# EAGLE design Freq.Counter.V.1.0 (EAGLE 6.3)
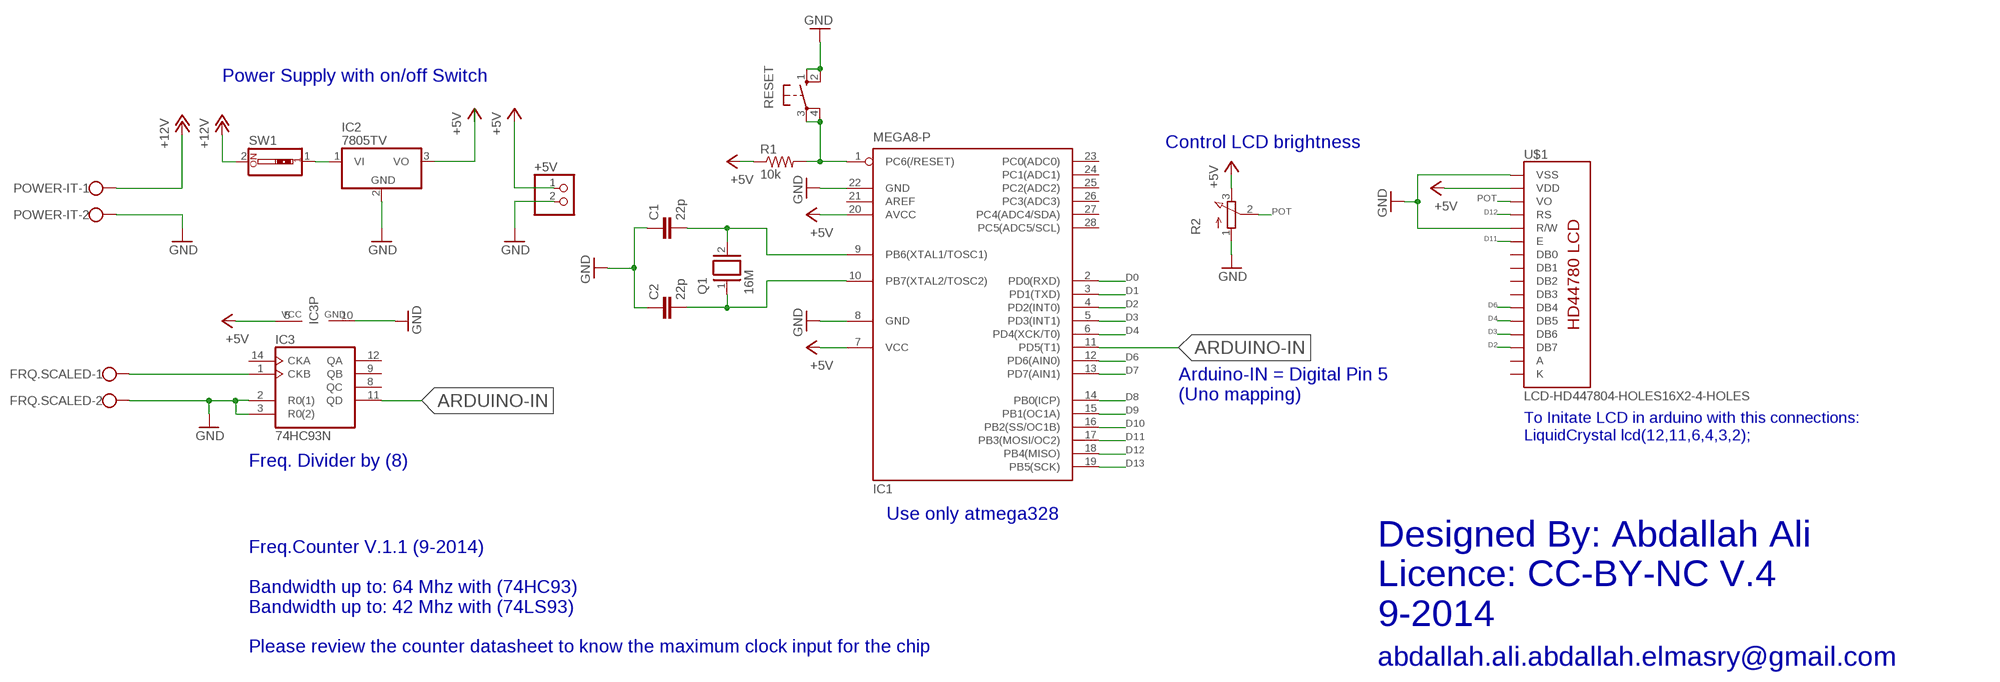
[diagram p0: schematic, sheet 1]

## Parts
+5V  PINHD-1X2  [1X02]
C1  22p  C-EU025-025X050  [C025-025X050]
C2  22p  C-EU025-025X050  [C025-025X050]
FRQ.SCALED  W237-102  [W237-102]
IC1  MEGA8-P  [DIL28-3]
IC2  7805TV  [TO220V]
IC3  74HC93N  [DIL14]
POWER-IT  W237-102  [W237-102]
Q1  16M  XTAL/S  [QS]
R1  10k  R-US_0207/10  [0207/10]
R2  3RP/1610N  [3RP/1610N]
RESET  10-XX  [B3F-10XX]
SW1  SW_DIP-1  [EDG-01]
U$1  LCD-HD447804-HOLES16X2-4-HOLES  [LCD-16X2-4HOLES]

## Nets
+5V: +5V.1 IC1.7(VCC) IC1.20(AVCC) IC2.3(VO) IC3.5(VCC) R1.1 R2.3(E) U$1.2(VDD)
+12V: POWER-IT.1 SW1.2
ARDUINO-IN: IC1.11(PD5(T1)) IC3.11(QD)
D0: IC1.2(PD0(RXD))
D1: IC1.3(PD1(TXD))
D2: IC1.4(PD2(INT0)) U$1.14(DB7)
D3: IC1.5(PD3(INT1)) U$1.13(DB6)
D4: IC1.6(PD4(XCK/T0)) U$1.12(DB5)
D6: IC1.12(PD6(AIN0)) U$1.11(DB4)
D7: IC1.13(PD7(AIN1))
D8: IC1.14(PB0(ICP))
D9: IC1.15(PB1(OC1A))
D10: IC1.16(PB2(SS/OC1B))
D11: IC1.17(PB3(MOSI/OC2)) U$1.6(E)
D12: IC1.18(PB4(MISO)) U$1.4(RS)
D13: IC1.19(PB5(SCK))
GND: +5V.2 C1.1 C2.1 FRQ.SCALED.2 IC1.8(GND) IC1.22(GND) IC2.2(GND) IC3.2(R0(1)) IC3.3(R0(2)) IC3.10(GND) POWER-IT.2 R2.1(A) RESET.1(S) RESET.2(S1) U$1.1(VSS) U$1.5(R/W)
N$1: IC1.1(PC6(/RESET)) R1.2 RESET.3(P) RESET.4(P1)
N$2: IC2.1(VI) SW1.1
N$3: FRQ.SCALED.1 IC3.1(CKB)
N$5: C1.2 IC1.9(PB6(XTAL1/TOSC1)) Q1.2
N$6: C2.2 IC1.10(PB7(XTAL2/TOSC2)) Q1.1
POT: R2.2(S) U$1.3(VO)
Unconnected: IC1.21(AREF) IC1.23(PC0(ADC0)) IC1.24(PC1(ADC1)) IC1.25(PC2(ADC2)) IC1.26(PC3(ADC3)) IC1.27(PC4(ADC4/SDA)) IC1.28(PC5(ADC5/SCL)) IC3.8(QC) IC3.9(QB) IC3.12(QA) IC3.14(CKA) U$1.7(DB0) U$1.8(DB1) U$1.9(DB2) U$1.10(DB3)

## Notes on the sheet
- Power Supply with on/off Switch
- Control LCD brightness
- Arduino-IN = Digital Pin 5 
  (Uno mapping)
- To Initate LCD in arduino with this connections:
  LiquidCrystal lcd(12,11,6,4,3,2);
- Freq. Divider by (8)
- Use only atmega328
- Designed By: Abdallah Ali
  Licence: CC-BY-NC V.4
  9-2014
- Freq.Counter V.1.1 (9-2014)
  
  Bandwidth up to: 64 Mhz with (74HC93)
  Bandwidth up to: 42 Mhz with (74LS93)
  
  Please review the counter datasheet to know the maximum clock input for the chip
- abdallah.ali.abdallah.elmasry@gmail.com

## Power pins joined to a net without a drawn wire
A: U$1.15(A)
K: U$1.16(K)

## Library data of the parts
+5V = pinhead:PINHD-1X2: PIN HEADER
C1 C2 = rcl:C-EU: CAPACITOR, European symbol
FRQ.SCALED POWER-IT = con-wago-500:W237-102: WAGO SCREW CLAMP; MPN: 237-102; OC_FARNELL: unknown; OC_NEWARK: 70K9898
IC1 = atmel:MEGA8-P: MICROCONTROLLER 8 Kbytes FLASH, 1 kbytes SRAM, 512 bytes EEPROM, USART, 4-channel 10 bit ADC, 2-channel 8 bit ADC Pin compatible with Atmega48, ATMega88, ATMega168 Source: avr.lbr; OC_FARNELL: unknown; OC_NEWARK: unknown
IC2 = linear:78*: Positive VOLTAGE REGULATOR Source: http://cache.national.com/ds/LM/LM78L05.pdf http://www.fairchildsemi.com/ds/LM/LM7805.pdf
IC3 = 74xx-eu:74*93: Decade, divide by twelve and binary COUNTER
Q1 = special:XTAL/S: CRYSTAL
R1 = rcl:R-US_: RESISTOR, American symbol
R2 = pot:3RP/1610N: 16mm Potentiometer one level Source: http://www.alphapotentiometers.net/html/16mm_pot_2.html
RESET = switch-omron:10-XX: OMRON SWITCH; MPN: B3F-1000; OC_FARNELL: 176432; OC_NEWARK: 36M3542
SW1 = special:SW_DIP-1: DIP SWITCH
U$1 = LCD-Library-EagleCAD-HD44780:LCD-HD44780

## Board
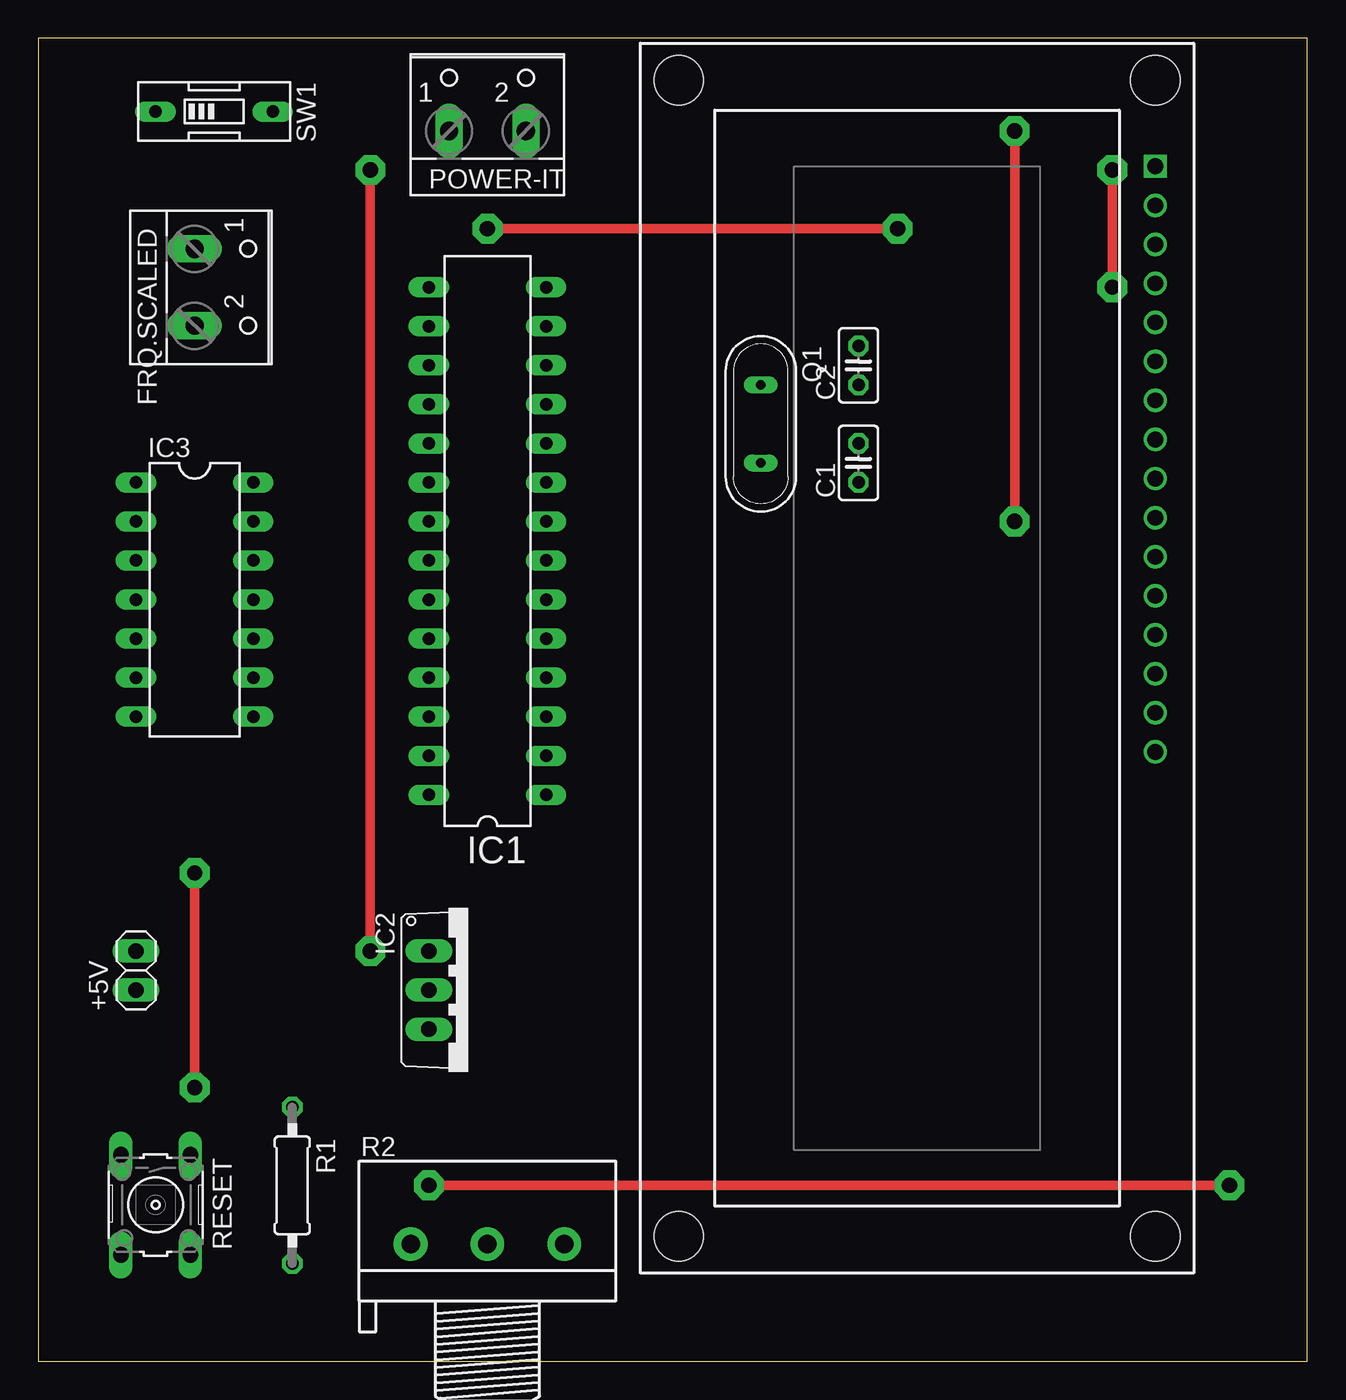
[diagram p1: board, top side]
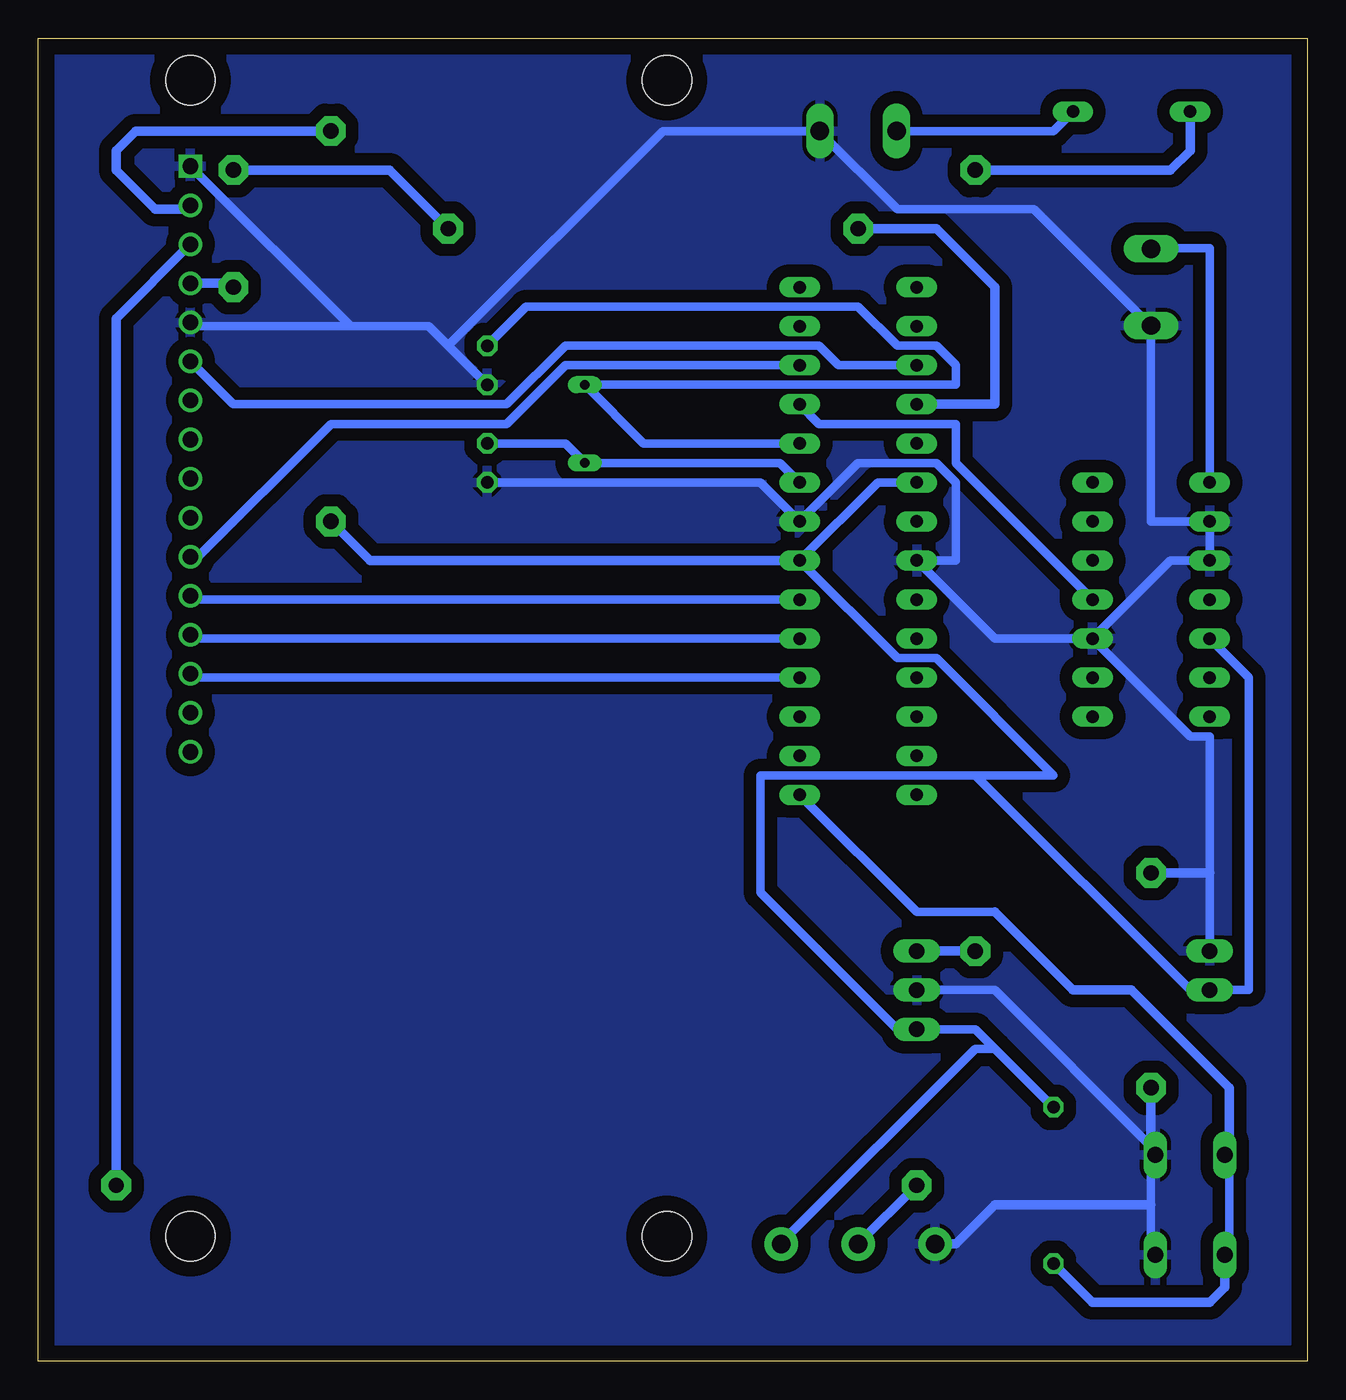
[diagram p2: board, bottom side, seen from below]

Size 82.53 x 86.03 mm. Coordinates in mm from the lower left corner, seen from the top.
Outline: 0,0 82.53,0 82.53,86.03 0,86.03 0,0
Copper layers (1*16): Top 0.035mm / dielectric 1.5mm / Bottom 0.035mm
Design rules "default *": minimum track width 22mil, minimum drill 24mil, track to track 10mil, track to pad 10mil, pad to pad 8mil, via to via 8mil, smd to smd 8mil, copper to edge 40mil, drill to drill 8mil, minimum pad ring 10mil, minimum via ring 8mil, stop-mask expansion 4mil, vias tented up to drill 0mil, thermal gap 10mil

### Footprints (pad centres in the part's own frame; a part is rotated, then mirrored left to right if it is on the bottom)
1X02 = drill 1.016 long: 1 -1.27,0; 2 1.27,0
C025-025X050 = drill 0.813 octagon: 1 -1.27,0; 2 1.27,0
W237-102 = drill 1.194 long: 1 -2.5,-1.27; 2 2.5,-1.27
DIL28-3 = drill 0.813 long: 1 -16.51,-3.81; 2 -13.97,-3.81; 3 -11.43,-3.81; 4 -8.89,-3.81; 5 -6.35,-3.81; 6 -3.81,-3.81; 7 -1.27,-3.81; 8 1.27,-3.81; 9 3.81,-3.81; 10 6.35,-3.81; 11 8.89,-3.81; 12 11.43,-3.81; 13 13.97,-3.81; 14 16.51,-3.81; 15 16.51,3.81; 16 13.97,3.81; 17 11.43,3.81; 18 8.89,3.81; 19 6.35,3.81; 20 3.81,3.81; 21 1.27,3.81; 22 -1.27,3.81; 23 -3.81,3.81; 24 -6.35,3.81; 25 -8.89,3.81; 26 -11.43,3.81; 27 -13.97,3.81; 28 -16.51,3.81
TO220V = drill 1.016 long: 1 -2.54,-2.54; 2 0,-2.54; 3 2.54,-2.54
DIL14 = drill 0.813 long: 1 -7.62,-3.81; 2 -5.08,-3.81; 3 -2.54,-3.81; 4 0,-3.81; 5 2.54,-3.81; 6 5.08,-3.81; 7 7.62,-3.81; 8 7.62,3.81; 9 5.08,3.81; 10 2.54,3.81; 11 0,3.81; 12 -2.54,3.81; 13 -5.08,3.81; 14 -7.62,3.81
QS = drill 0.61 long: 1 -2.54,0; 2 2.54,0
0207/10 = drill 0.813 octagon: 1 -5.08,0; 2 5.08,0
3RP/1610N = drill 1.2 pad 2.184: 1 -5,0; 2 0,0; 3 5,0
B3F-10XX = drill 1.016 long: 1 -3.251,2.261; 2 3.251,2.261; 3 -3.251,-2.261; 4 3.251,-2.261
EDG-01 = drill 0.813 long: 1 0,-3.81; 2 0,3.81
LCD-16X2-4HOLES = drill 1.016 square: 1 -32,15.5 | drill 1.016: 2 -29.46,15.5; 3 -26.92,15.5; 4 -24.38,15.5; 5 -21.84,15.5; 6 -19.3,15.5; 7 -16.76,15.5; 8 -14.22,15.5; 9 -11.68,15.5; 10 -9.14,15.5; 11 -6.6,15.5; 12 -4.06,15.5; 13 -1.52,15.5; 14 1.02,15.5; 15 3.56,15.5; 16 6.1,15.5 | hole 3.2: -37.6,15.5; -37.6,-15.5; 37.6,-15.5; 37.6,15.5

### Placement (x,y rotation side)
+5V  6.35,25.4 90 top
C1  53.34,58.42 90 top
C2  53.34,64.77 90 top
FRQ.SCALED  11.43,69.85 270 top
IC1  29.21,53.34 90 top
IC2  27.94,24.13 270 top
IC3  10.16,49.53 270 top
POWER-IT  29.21,81.28 0 top
Q1  46.99,60.96 270 top
R1  16.51,11.43 270 top
R2  29.21,7.62 0 top
RESET  7.62,10.16 270 top
SW1  11.43,81.28 270 top
U$1  57.15,45.72 270 top

### Tracks (layer width: path | path; a pad name or v marks a point on that pad's centre or on a via)
+5V  (via drill 1 pad 1.93)
  Top 0.61: v63.5,54.61 v63.5,80.01
  Bottom 0.559: 20.32,20.32 21.59,21.59 IC2.3 26.67,21.59 35.56,30.48 35.56,38.1 21.59,38.1 | 20.32,20.32 21.59,20.32 34.29,7.62 R2.3 | IC1.20 27.94,57.15 IC1.7 26.67,45.72 24.13,45.72 16.51,38.1 21.59,38.1 | IC3.5 3.81,44.45 3.81,24.13 +5V.1 7.62,24.13 21.59,38.1 | 20.32,20.32 R1.1
  Bottom 0.61: IC1.7 60.96,52.07 v63.5,54.61 | v63.5,80.01 76.2,80.01 77.47,78.74 77.47,77.47 74.93,74.93 72.9,74.93 U$1.2
+12V
  Bottom 0.559: SW1.2 16.51,80.01 POWER-IT.1
ARDUINO-IN
  Bottom 0.559: IC3.11 22.86,58.42 22.86,60.96 31.75,60.96 IC1.11
D2
  Bottom 0.559: IC1.4 72.39,44.45 U$1.14
D3
  Bottom 0.559: IC1.5 72.39,46.99 U$1.13
D4
  Bottom 0.559: IC1.6 72.39,49.53 U$1.12
D6
  Bottom 0.559: IC1.12 48.26,64.77 52.07,60.96 63.5,60.96 72.39,52.07 U$1.11
D11
  Bottom 0.559: IC1.17 30.48,64.77 31.75,66.04 48.26,66.04 52.07,62.23 69.85,62.23 72.39,64.77 U$1.6
D12  (via drill 1 pad 1.93)
  Top 0.61: v69.85,69.85 v69.85,77.47 | v55.88,73.66 v29.21,73.66
  Bottom 0.61: U$1.4 70.1,70.1 v69.85,69.85 | v69.85,77.47 59.69,77.47 v55.88,73.66 | v29.21,73.66 24.13,73.66 20.32,69.85 20.32,62.23 IC1.18
GND  (via drill 1 pad 1.93)
  Top 0.61: v10.16,17.78 v10.16,31.75
  Bottom 0.559: 55.88,66.04 57.15,67.31 62.23,67.31 | 55.88,66.04 C2.1 | 62.23,67.31 72.39,67.31 U$1.5 | 62.23,67.31 72.39,77.47 U$1.1 | C1.1 35.56,57.15 IC1.8 29.21,58.42 24.13,58.42 22.86,57.15 22.86,52.07 IC1.22 20.32,46.99 IC3.10 | IC3.10 8.89,52.07 IC3.3 IC3.2 10.16,54.61 10.16,67.31 | IC3.10 7.62,40.64 6.35,40.64 6.35,31.75 +5V.2 | 55.88,66.04 41.91,80.01 31.75,80.01 | IC2.2 20.32,24.13 10.16,13.97 RESET.1 10.16,12.7 10.16,10.16 10.16,7.62 RESET.2 | 31.75,80.01 26.67,74.93 17.78,74.93 10.16,67.31 | 31.75,80.01 POWER-IT.2 | 10.16,67.31 FRQ.SCALED.2
  Bottom 0.61: 10.16,13.97 v10.16,17.78 | v10.16,31.75 6.35,31.75 | R2.1 22.86,7.62 20.32,10.16 10.16,10.16
  pour Bottom (isolate 0.813): 1.27,1.27 81.28,1.27 81.28,85.09 1.27,85.09
N$1
  Bottom 0.559: IC1.1 25.4,29.21 20.32,29.21 | 5.08,13.97 RESET.3 5.08,12.7 5.08,7.62 RESET.4
  Bottom 0.61: RESET.4 5.36,4.8 6.35,3.81 13.97,3.81 R1.2 | 5.08,13.97 5.08,17.78 11.43,24.13 15.24,24.13 20.32,29.21
N$2  (via drill 1 pad 1.93)
  Top 0.61: v21.59,26.67 v21.59,77.47
  Bottom 0.61: IC2.1 v21.59,26.67 | v21.59,77.47 8.89,77.47 7.62,78.74 SW1.1
N$3
  Bottom 0.559: IC3.1 6.35,72.39 10.16,72.39 FRQ.SCALED.1
N$4  (via drill 1 pad 1.93)
  other vias: 10.16,31.75
N$5
  Bottom 0.559: C1.2 48.26,59.69 Q1.2 34.29,58.42 IC1.9
N$6
  Bottom 0.559: IC1.10 43.18,59.69 Q1.1 22.86,63.5 22.86,64.77 24.13,66.04 26.67,66.04 29.21,68.58 50.8,68.58 C2.2
N$7  (via drill 1 pad 1.93)
  other vias: 10.16,17.78
N$8  (via drill 1 pad 1.93)
  other vias: 21.59,26.67
N$9  (via drill 1 pad 1.93)
  other vias: 21.59,77.47
POT  (via drill 1 pad 1.93)
  Top 0.61: v25.4,11.43 v77.47,11.43
  Bottom 0.61: R2.2 v25.4,11.43 | v77.47,11.43 77.47,67.82 U$1.3